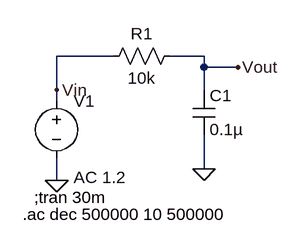
[diagram p0: schematic 3-2.asc]
3-2.asc, the LTspice schematic file:
Version 4
SHEET 1 880 680
WIRE 160 80 80 80
WIRE 288 80 240 80
WIRE 288 96 288 80
WIRE 336 96 288 96
WIRE 80 128 80 80
WIRE 288 128 288 96
WIRE 80 144 80 128
WIRE 288 240 288 192
WIRE 80 256 80 224
FLAG 288 240 0
FLAG 80 256 0
FLAG 336 96 Vout
FLAG 80 128 Vin
SYMBOL cap 272 128 R0
SYMATTR InstName C1
SYMATTR Value 0.1µ
SYMBOL res 256 64 R90
WINDOW 0 0 56 VBottom 2
WINDOW 3 32 56 VTop 2
SYMATTR InstName R1
SYMATTR Value 10k
SYMBOL voltage 80 128 R0
WINDOW 123 24 124 Left 2
WINDOW 39 0 0 Left 0
SYMATTR Value2 AC 1.2
SYMATTR InstName V1
SYMATTR Value ""
TEXT 48 280 Left 2 !;tran 30m
TEXT 32 304 Left 2 !.ac dec 500000 10 500000

The netlist it stands for:
* 3-2.asc
C1 Vout 0 0.1µ
R1 Vout Vin 10k
V1 Vin 0 AC 1.2
;tran 30m
.ac dec 500000 10 500000
.backanno
.end